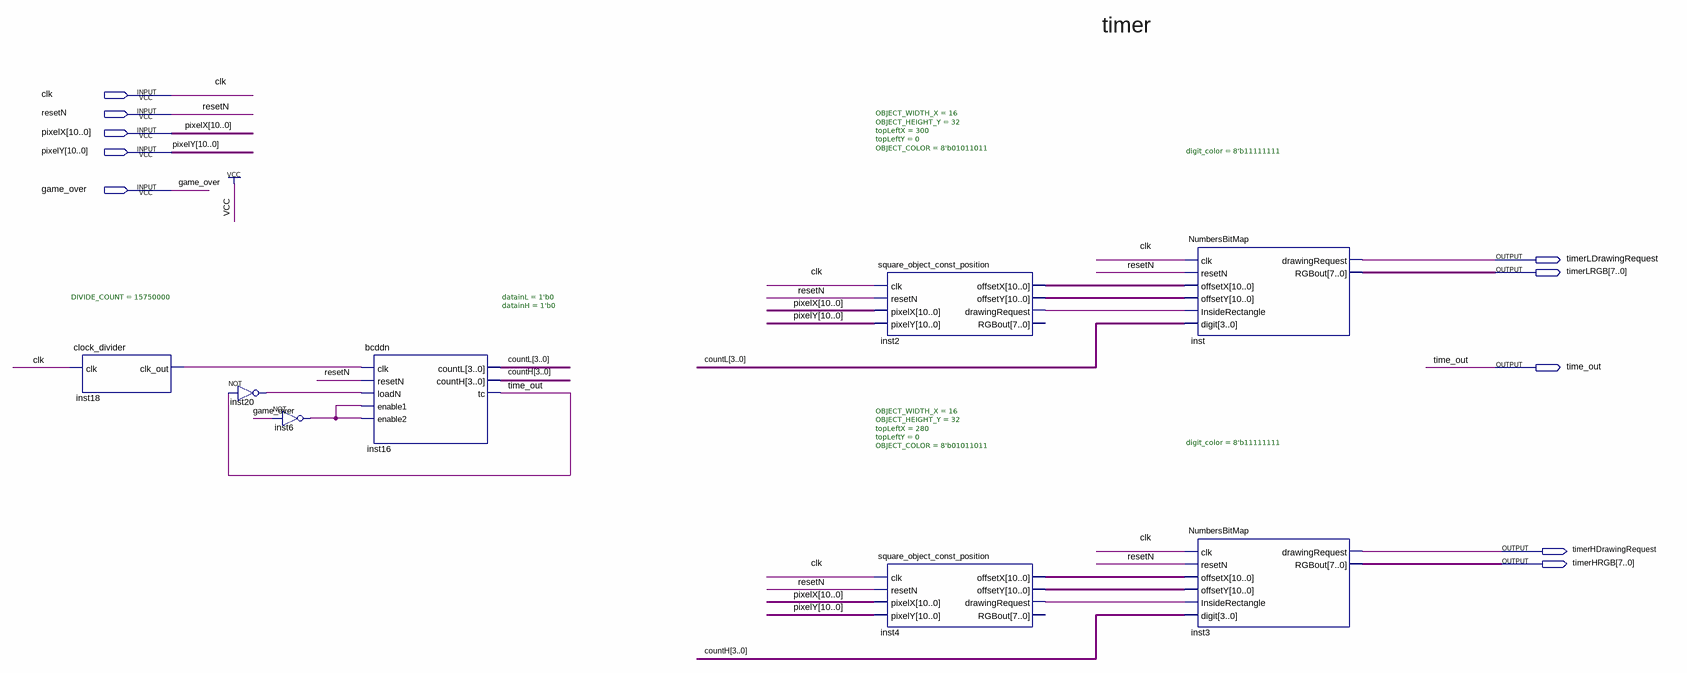
[diagram p0: schematic sheet]
// Quartus schematic TIMER_DISPLAY.bdf as structural Verilog: 8 symbols, 10 pins
module TIMER_DISPLAY (
  input  clk,
  input  resetN,
  input  [10:0] pixelX,
  input  [10:0] pixelY,
  input  game_over,
  output timerLDrawingRequest,
  output [7:0] timerLRGB,
  output time_out,
  output timerHDrawingRequest,
  output [7:0] timerHRGB
);

  wire inst2_drawingrequest, inst4_drawingrequest, inst6_out, inst18_clk_out, inst20_out;
  wire [3:0] countH, countL;
  wire [10:0] inst2_offsetx, inst2_offsety, inst4_offsetx, inst4_offsety;

  clock_divider #(.DIVIDE_COUNT(15750000)) inst18 (.clk(clk), .clk_out(inst18_clk_out));
  not inst20 (inst20_out, time_out);
  not inst6 (inst6_out, game_over);
  bcddn #(.datainL(1'b0), .datainH(1'b0)) inst16 (
    .clk(inst18_clk_out), .resetN(resetN), .loadN(inst20_out), .enable1(inst6_out), .enable2(inst6_out),
    .countL(countL), .countH(countH), .tc(time_out));
  square_object_const_position #(.OBJECT_WIDTH_X(16), .OBJECT_HEIGHT_Y(32), .topLeftX(300), .topLeftY(0), .OBJECT_COLOR(8'b01011011)) inst2 (
    .clk(clk), .resetN(resetN), .pixelX(pixelX), .pixelY(pixelY), .offsetX(inst2_offsetx),
    .offsetY(inst2_offsety), .drawingRequest(inst2_drawingrequest));  // open: RGBout
  square_object_const_position #(.OBJECT_WIDTH_X(16), .OBJECT_HEIGHT_Y(32), .topLeftX(280), .topLeftY(0), .OBJECT_COLOR(8'b01011011)) inst4 (
    .clk(clk), .resetN(resetN), .pixelX(pixelX), .pixelY(pixelY), .offsetX(inst4_offsetx),
    .offsetY(inst4_offsety), .drawingRequest(inst4_drawingrequest));  // open: RGBout
  NumbersBitMap #(.digit_color(8'b11111111)) inst (
    .clk(clk), .resetN(resetN), .offsetX(inst2_offsetx), .offsetY(inst2_offsety),
    .InsideRectangle(inst2_drawingrequest), .digit(countL), .drawingRequest(timerLDrawingRequest),
    .RGBout(timerLRGB));
  NumbersBitMap #(.digit_color(8'b11111111)) inst3 (
    .clk(clk), .resetN(resetN), .offsetX(inst4_offsetx), .offsetY(inst4_offsety),
    .InsideRectangle(inst4_drawingrequest), .digit(countH), .drawingRequest(timerHDrawingRequest),
    .RGBout(timerHRGB));

  // Notes on the sheet:
  //   timer
endmodule
